# Altium project PCB_Project1.PrjPCB
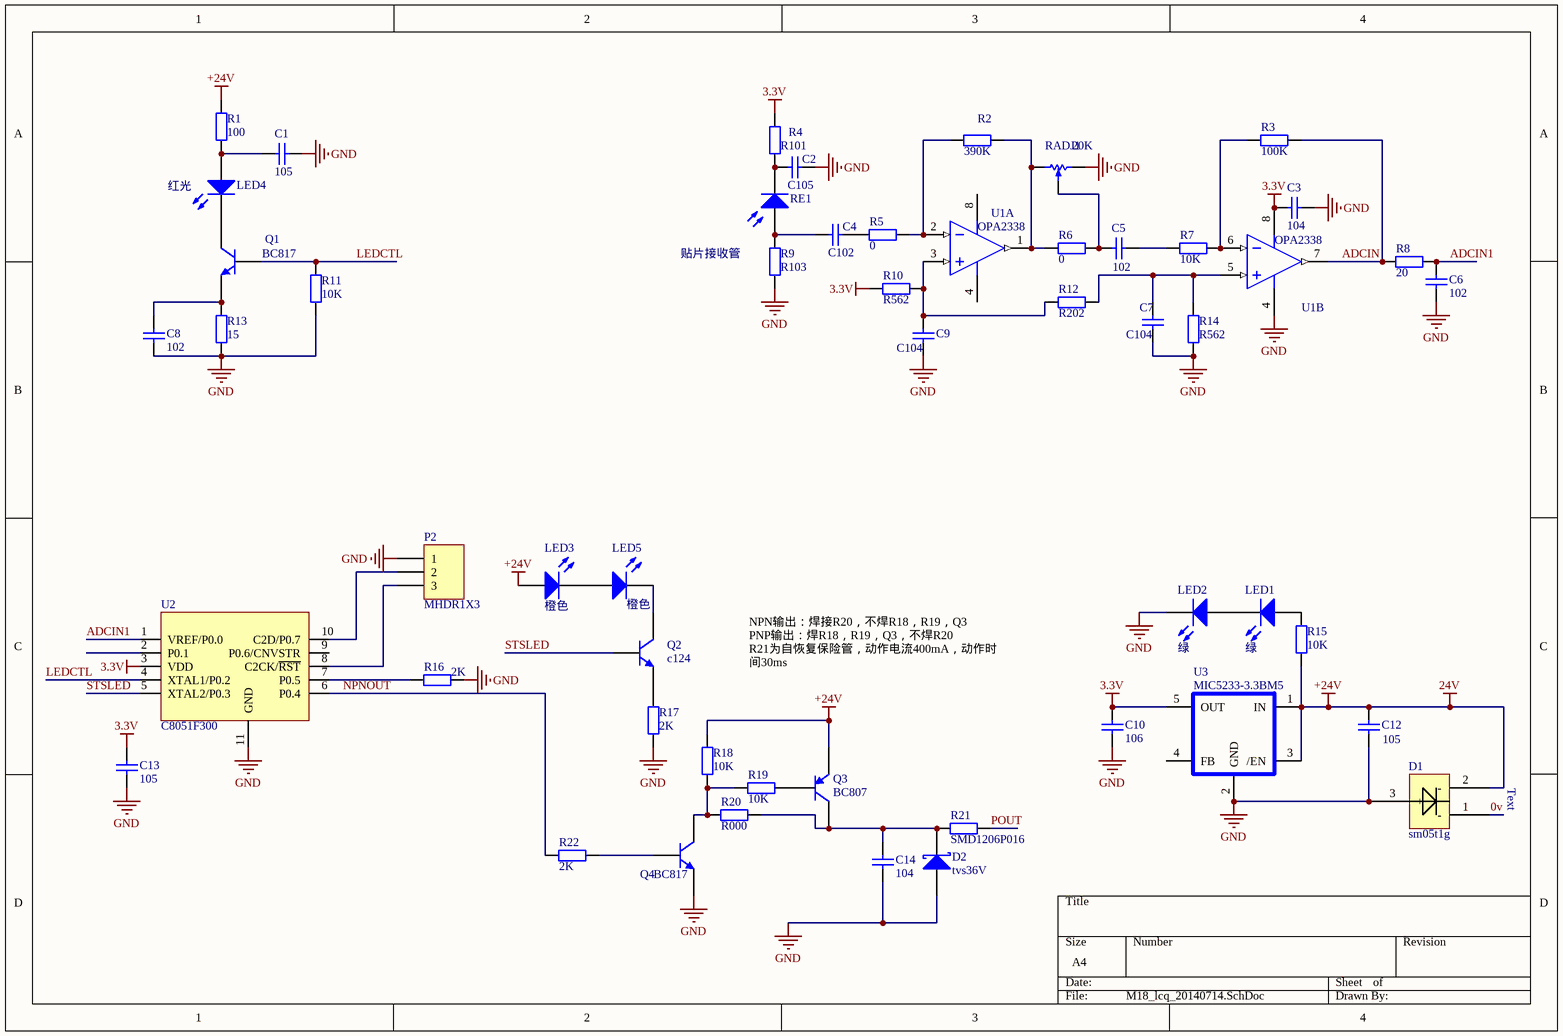
[diagram p0: M18_lcq_20140714.SchDoc]
1 sheet, 52 parts. Net scope: global (net labels, ports and power ports of the same name join across sheets).
Board file: M18PNP新 - 副本.PCBDOC

## Sheet M18_lcq_20140714.SchDoc
size A4

### Parts
C1  105  [C0805]
C2  value C105  [C0603]  (hidden comment: C104)
C3  value 104  [C0805]  (hidden comment: C106)
C4  value C102  [C0603]  (hidden comment: C104)
C5  value 102  [C0603]  (hidden comment: C104)
C6  value 102  [C0603]  (hidden comment: C104)
C7  C104  [C0603]
C8  value 102  [C0603]  (hidden comment: C104)
C9  C104  [C0603]
C10  value 106  [C0805]  (hidden comment: C106)
C12  105  [C0805]
C13  value 105  [C0805]  (hidden comment: C106)
C14  value 104  [C0603]  (hidden comment: C104)
D1  sm05t1g  [SOT23A]
D2  tvs36V  [3216A]
LED1  绿  [d0603]
LED2  绿  [d0603]
LED3  橙色  [d0603]
LED4  红光  [LED-1210]
LED5  橙色  [d0603]
P2  MHDR1X3  [MHDR1X3]
Q1  BC817  [SOT23A]
Q2  c124  [SOT23A]
Q3  BC807  [SOT23A]
Q4  BC817  [SOT23A]
R1  100  [R0603]
R2  390K  [R0603-A]
R3  100K  [R0603-A]
R4  R101  [R0603-A]
R5  0  [R0603-A]
R6  0  [R0603-A]
R7  10K  [R0603-A]
R8  20  [R0603-A]
R9  R103  [R0603-A]
R10  R562  [R0603-A]
R11  10K  [R0603-A]
R12  R202  [R0603-A]
R13  15  [R0603-A]
R14  R562  [R0603-A]
R15  10K  [R0603-A]
R16  2K  [R0603-A]
R17  2K  [R0603-A]
R18  10K  [R0603-A]
R19  10K  [R0603-A]
R20  R000  [R0603-A]
R21  SMD1206P016  [3216A]
R22  2K  [R0603-A]
RADJ1  20K  [POT4MM-2]
RE1  贴片接收管  [LED-1210]
U1  OPA2338  [SOT23-8]  (parts A,B of 2)
U2  C8051F300  [IC*]
U3  MIC5233-3.3BM5  [SOT-457]

### Nets
3.3V: C3.1 C10.1 C13.1 R4.1 R10.2 U1.8(VCC) U2.3(VDD) U3.5(OUT)
+24V: C12.1 D1.2(-) LED3.1(A) Q3.2(E) R1.1 R15.1 R18.1 U3.1(IN) U3.3(/EN)  [also labelled 24V]
GND: C1.2 C2.2 C3.2 C6.1 C7.2 C8.2 C9.2 C10.2 C12.2 C13.2 C14.2 D1.3(+) D2.1(A) LED2.2(K) P2.1 Q4.2(E) R9.2 R11.1 R13.1 R14.2 R16.2 R17.1 RADJ1.CW(+) U1.4(VEE) U2.11(GND) U3.2(GND)
0v: D1.1(-)
ADCIN: R3.2 R8.1 U1.7(OUT)
ADCIN1: C6.2 R8.2 U2.1(VREF/P0.0)
LEDCTL: Q1.1(B) R11.2 U2.4(XTAL1/P0.2)
NPNOUT: R22.2 U2.6(P0.4)
POUT: R21.2
STSLED: Q2.1(B) U2.5(XTAL2/P0.3)
NetC1_1: C1.1 LED4.1(A) R1.2
NetC2_1: C2.1 R4.2 RE1.2(K)
NetC4_1: C4.1 R9.1 RE1.1(A)
NetC4_2: C4.2 R5.1
NetC5_1: C5.1 R6.2 RADJ1.W
NetC5_2: C5.2 R7.2
NetC7_1: C7.1 R12.2 R14.1 U1.5(IN+)
NetC8_1: C8.1 Q1.2(E) R13.2
NetC9_1: C9.1 R10.1 R12.1 U1.3(IN+)
NetC14_1: C14.1 D2.2(K) Q3.3(C) R20.2 R21.1
NetLED1_1: LED1.1(A) R15.2
NetLED1_2: LED1.2(K) LED2.1(A)
NetLED3_2: LED3.2(K) LED5.1(A)
NetLED4_2: LED4.2(K) Q1.3(C)
NetLED5_2: LED5.2(K) Q2.3(C)
NetP2_2: P2.2 U2.10(C2D/P0.7)
NetP2_3: P2.3 U2.8(C2CK/~{RST})
NetQ2_2: Q2.2(E) R17.2
NetQ3_1: Q3.1(B) R19.2
NetQ4_1: Q4.1(B) R22.1
NetQ4_3: Q4.3(C) R18.2 R19.1 R20.1
NetR2_1: R2.1 R5.2 U1.2(IN-)
NetR2_2: R2.2 R6.1 RADJ1.CCW(-) U1.1(OUT)
NetR3_1: R3.1 R7.1 U1.6(IN-)
NetR16_1: R16.1 U2.7(P0.5)

Not connected (* = marked no-connect by the designer): U2 2(P0.1) 9(P0.6/CNVSTR); U3 4(FB)

### Notes on the sheet
- NPN输出：焊接R20，不焊R18，R19，Q3
  PNP输出：焊R18，R19，Q3，不焊R20
  R21为自恢复保险管，动作电流400mA，动作时间30ms
- (in symbol sm05t1g) Text

### Library data of the parts
C1-C10 C13 C14 = Cap: Capacitor; Published: 8-Jun-2000; LatestRevisionDate: 17-Jul-2002; LatestRevisionNote: Re-released for DXP Platform.; PackageReference: RAD-0.3; Publisher: Altium Limited
  C1: Value: 105
  C7 C9: Value: C104
C12 = Cap: Capacitor; Value: C106; Published: 8-Jun-2000; LatestRevisionDate: 17-Jul-2002; LatestRevisionNote: Re-released for DXP Platform.; PackageReference: RAD-0.3; Publisher: Altium Limited
D2 = D Schottky: Schottky Diode; Published: 8-Jun-2000; LatestRevisionDate: 17-Jul-2002; LatestRevisionNote: Re-released for DXP Platform.; PackageReference: SMB; Publisher: Altium Limited; Code_JEDEC: DO-214-AA
LED1-LED5 = LED0: Typical INFRARED GaAs LED; Published: 8-Jun-2000; LatestRevisionDate: 08-Jul-2005; LatestRevisionNote: Mech Layer 1 removed.; PackageReference: LED-0; Publisher: Altium Limited
P2 = MHDR1X3: Header, 3-Pin; LatestRevisionDate: 17-Jul-2002; LatestRevisionNote: Re-released for DXP Platform.; Publisher: Altium Limited
Q1 Q2 Q4 = MMBT3904: NPN Switching Transistor; Published: 17-Sep-2003; DatasheetVersion: 13-May-2002; PackageVersion: May-1999; PackageReference: SOT23; Publisher: Altium Limited; PackageDescription: SOT-23; 3 Leads; Body 3.0 x 2.5 mm, inc. leads (LxW max); ComponentLink1Description: Manufacturer Link; ComponentLink1URL: http://www.semiconductors.philips.com/; ComponentLink2Description: Datasheet; ComponentLink2URL: http://www.semiconductors.philips.com/acrobat/datasheets/MMBT3904_4.pdf
Q3 = MMBT3906: PNP Switching Transistor; Published: 17-Sep-2003; DatasheetVersion: 11-Apr-2000; PackageVersion: May-1999; PackageReference: SOT23; Publisher: Altium Limited; PackageDescription: SOT-23; 3 Leads; Body 3.0 x 2.5 mm, inc. leads (LxW max); ComponentLink1Description: Manufacturer Link; ComponentLink1URL: http://www.semiconductors.philips.com/; ComponentLink2Description: Datasheet; ComponentLink2URL: http://www.semiconductors.philips.com/acrobat/datasheets/MMBT3906_2.pdf
R1-R6 R8-R10 R12-R14 R16 R17 R22 = Res2: Resistor; Value: 10K; Published: 8-Jun-2000; LatestRevisionDate: 17-Jul-2002; LatestRevisionNote: Re-released for DXP Platform.; PackageReference: AXIAL-0.4; Publisher: Altium Limited
R7 R11 R15 R18 R19 = Res2: Resistor; Published: 8-Jun-2000; LatestRevisionDate: 17-Jul-2002; LatestRevisionNote: Re-released for DXP Platform.; PackageReference: AXIAL-0.4; Publisher: Altium Limited; Value: 10K
R20 R21 = Res2: Resistor; Value: 0R; Published: 8-Jun-2000; LatestRevisionDate: 17-Jul-2002; LatestRevisionNote: Re-released for DXP Platform.; PackageReference: AXIAL-0.4; Publisher: Altium Limited
RADJ1 = RPot SM: Square Trimming Potentiometer; Published: 17-Dec-2003; DatasheetDocument: Oct-2003; PackageReference: POT4MM-2; Publisher: Altium Limited; ComponentLink1Description: Manufacturer Link; ComponentLink1URL: http://bourns.com/2/search.html
RE1 = Photo Sen: Photosensitive Diode; Published: 24-Mar-1999; LatestRevisionDate: 17-Jul-2002; LatestRevisionNote: Re-released for DXP Platform.; PackageReference: PIN2; Publisher: Altium Limited
U1 = LM833D: Dual Low Noise, Audio Amplifier; Published: 17-Jul-2002; LatestRevisionDate: 13-Apr-2006; LatestRevisionNote: IPC-7351 Footprint Added.; DatasheetVersion: 1996; PackageVersion: 1996; PackageReference: 751-05; Publisher: Altium Limited; PackageDescription: 8-Pin Small Outline Integrated Circuit 1.27 mm Pitch; Code_JEDEC: MS-012-AA; Code_IPC: SOIC127P600-8; ComponentLink1Description: Datasheet; ComponentLink1URL: http://www.onsemi.com/pub/Collateral/LM833-D.PDF
U2 = PIC16C505
U3 = TPS77001